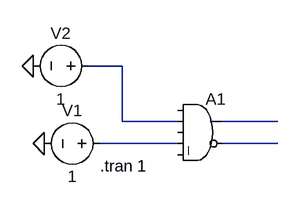
[diagram p0: schematic Draft3.asc]
Draft3.asc, the LTspice schematic file:
Version 4.1
SHEET 1 880 680
WIRE 0 128 -48 128
WIRE 0 208 0 128
WIRE 80 208 0 208
WIRE 224 208 144 208
WIRE 80 240 -32 240
WIRE 224 240 144 240
FLAG -128 128 0
FLAG -112 240 0
SYMBOL Digital\\and 112 160 R0
SYMATTR InstName A1
SYMBOL voltage -16 240 R90
WINDOW 0 -32 56 VBottom 2
WINDOW 3 32 56 VTop 2
WINDOW 123 0 0 Left 0
WINDOW 39 0 0 Left 0
SYMATTR InstName V1
SYMATTR Value 1
SYMBOL voltage -32 128 R90
WINDOW 0 -32 56 VBottom 2
WINDOW 3 32 56 VTop 2
WINDOW 123 0 0 Left 0
WINDOW 39 0 0 Left 0
SYMATTR InstName V2
SYMATTR Value 1
TEXT -32 272 Left 2 !.tran 1

The netlist it stands for:
* Draft3.asc
A1 0 N001 0 N003 0 N004 N002 0 AND
V1 N003 0 1
V2 N001 0 1
.tran 1
.backanno
.end